# EAGLE design 2WLS-30W (EAGLE 7.4.0)

## Sheet 1 of 2
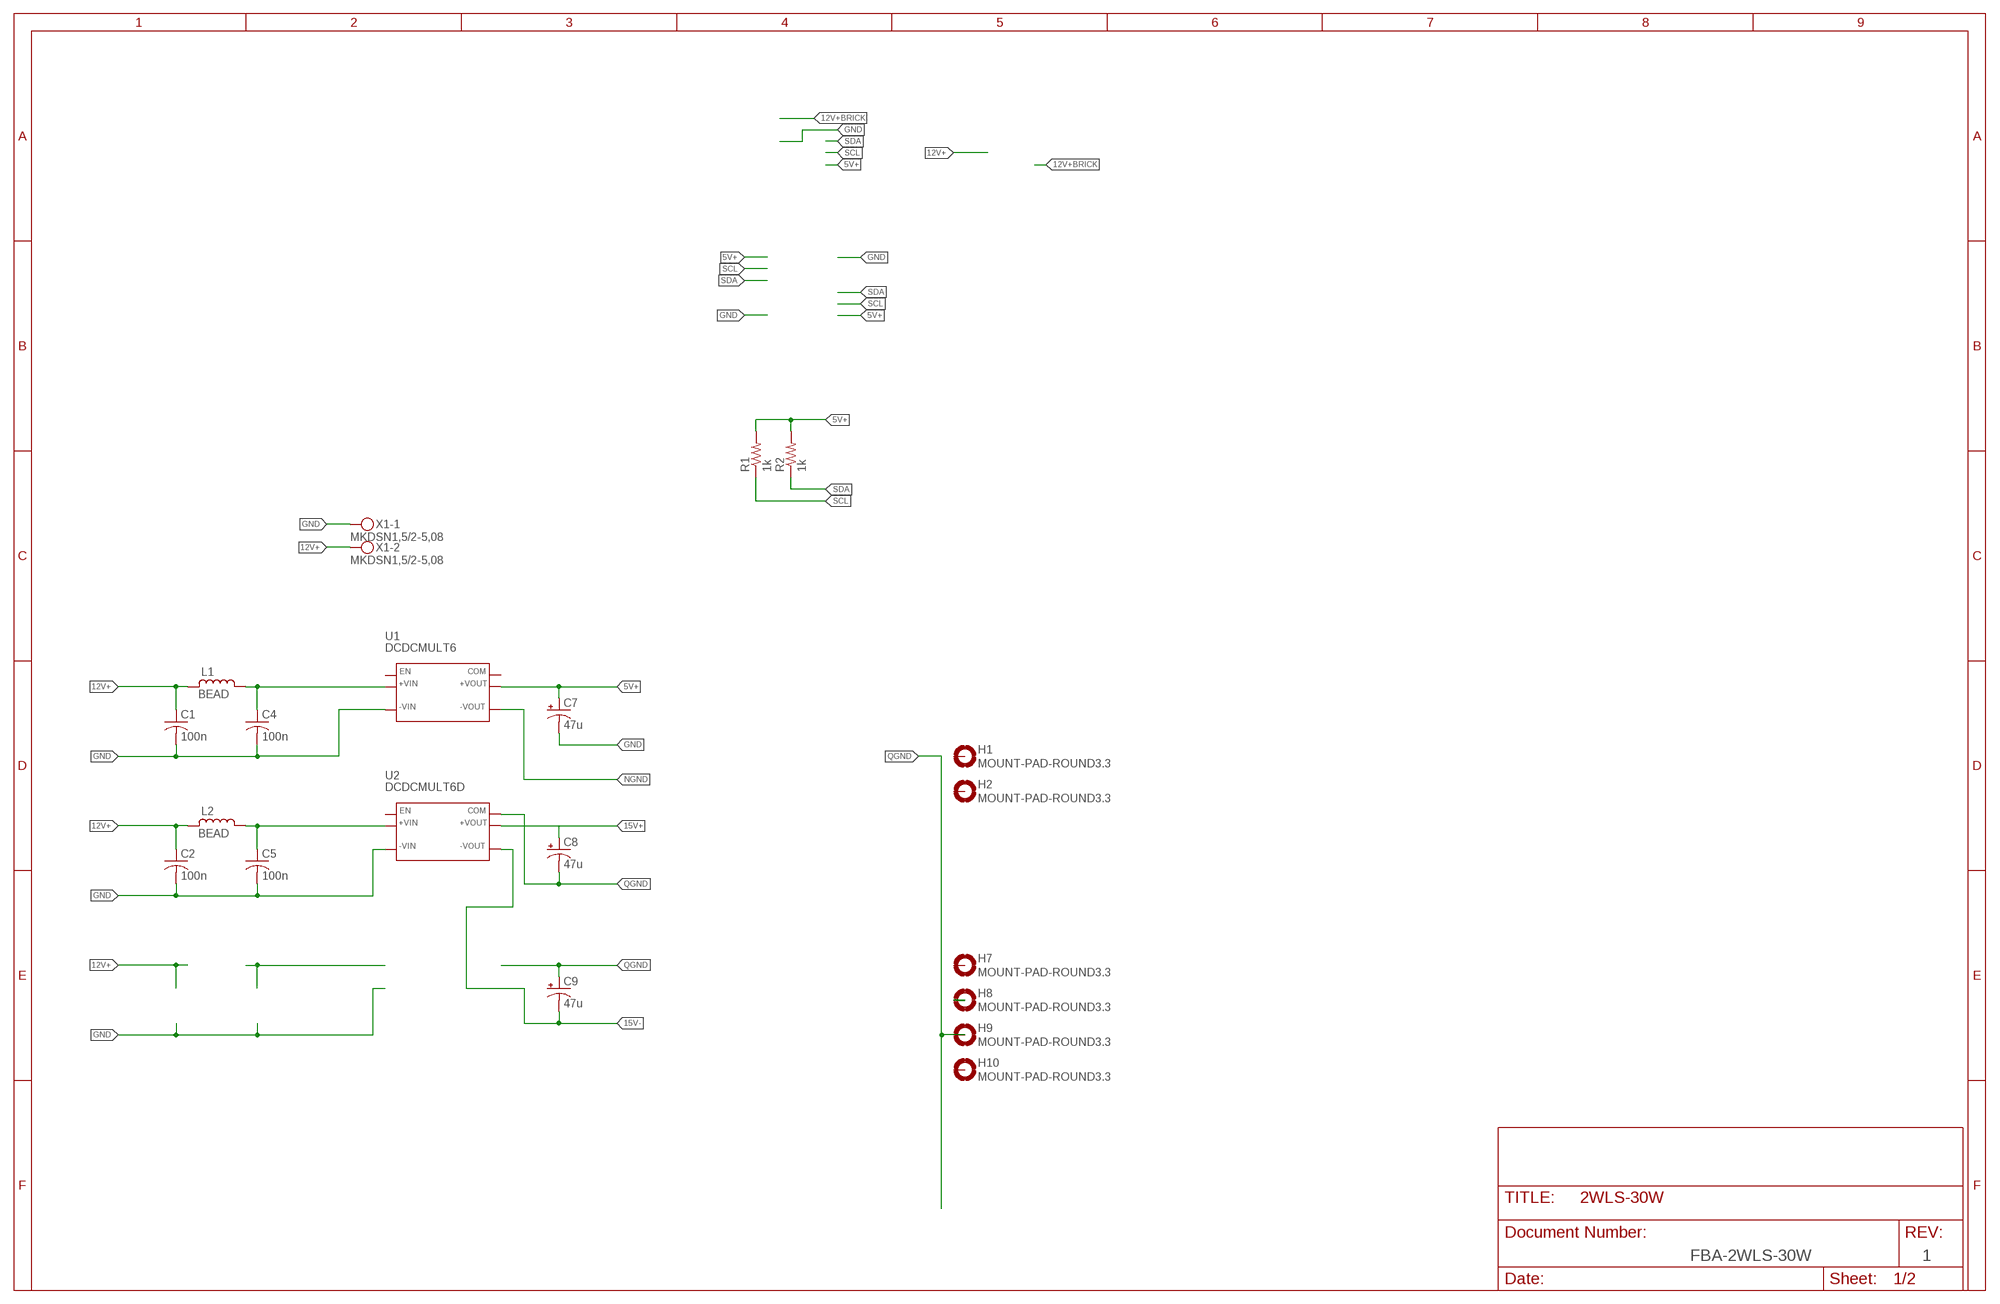
[diagram p0: schematic, sheet 1]

### Parts
C1  100n  C-US050-025X075  [C050-025X075]
C2  100n  C-US050-025X075  [C050-025X075]
C4  100n  C-US050-025X075  [C050-025X075]
C5  100n  C-US050-025X075  [C050-025X075]
C7  47u  CPOL-USE5-6  [E5-6]
C8  47u  CPOL-USE5-6  [E5-6]
C9  47u  CPOL-USE5-6  [E5-6]
H1  MOUNT-PAD-ROUND3.3  [3,3-PAD]
H2  MOUNT-PAD-ROUND3.3  [3,3-PAD]
H7  MOUNT-PAD-ROUND3.3  [3,3-PAD]
H8  MOUNT-PAD-ROUND3.3  [3,3-PAD]
H9  MOUNT-PAD-ROUND3.3  [3,3-PAD]
H10  MOUNT-PAD-ROUND3.3  [3,3-PAD]
L1  BEAD  L  [BEAD]
L2  BEAD  L  [BEAD]
R1  1k  R-US_0207/7  [0207/7]
R2  1k  R-US_0207/7  [0207/7]
U1  DCDCMULT6  [EC6CMULT]
U2  DCDCMULT6D  [EC6CMULTD]
X1  MKDSN1,5/2-5,08  [MKDSN1,5/2-5,08]

### Nets
5V+: C7.+ R1.2 R2.2 U1.VO1+(+VOUT) U1.VO+(+VOUT)
12V+: C1.1 C2.1 L1.1 L2.1 X1.2
15V+: C8.+ U2.VO1+(+VOUT) U2.VO+(+VOUT)
15V-: C9.- U2.VO1-(-VOUT) U2.VO-(-VOUT)
GND: C1.2 C2.2 C4.2 C5.2 C7.- U1.VIN1-(-VIN) U1.VIN-(-VIN) U2.VIN1-(-VIN) U2.VIN-(-VIN) X1.1
N$1: C5.1 L2.2 U2.VIN1+(+VIN) U2.VIN+(+VIN)
N$3: C4.1 L1.2 U1.VIN1+(+VIN) U1.VIN+(+VIN)
N$5: H8.B3,3(MOUNT)
NGND: U1.VO1-(-VOUT) U1.VO-(-VOUT)
QGND: C8.- C9.+ U2.COM U2.COM1(COM)
SCL: R1.1
SDA: R2.1
Unconnected: H1.B3,3(MOUNT) H2.B3,3(MOUNT) H7.B3,3(MOUNT) H9.B3,3(MOUNT) H10.B3,3(MOUNT) U1.ONOFF1(EN) U1.ONOFF(EN) U2.ONOFF1(EN) U2.ONOFF(EN)

### Notes on the sheet
- FBA-2WLS-30W | 1

## Sheet 2 of 2
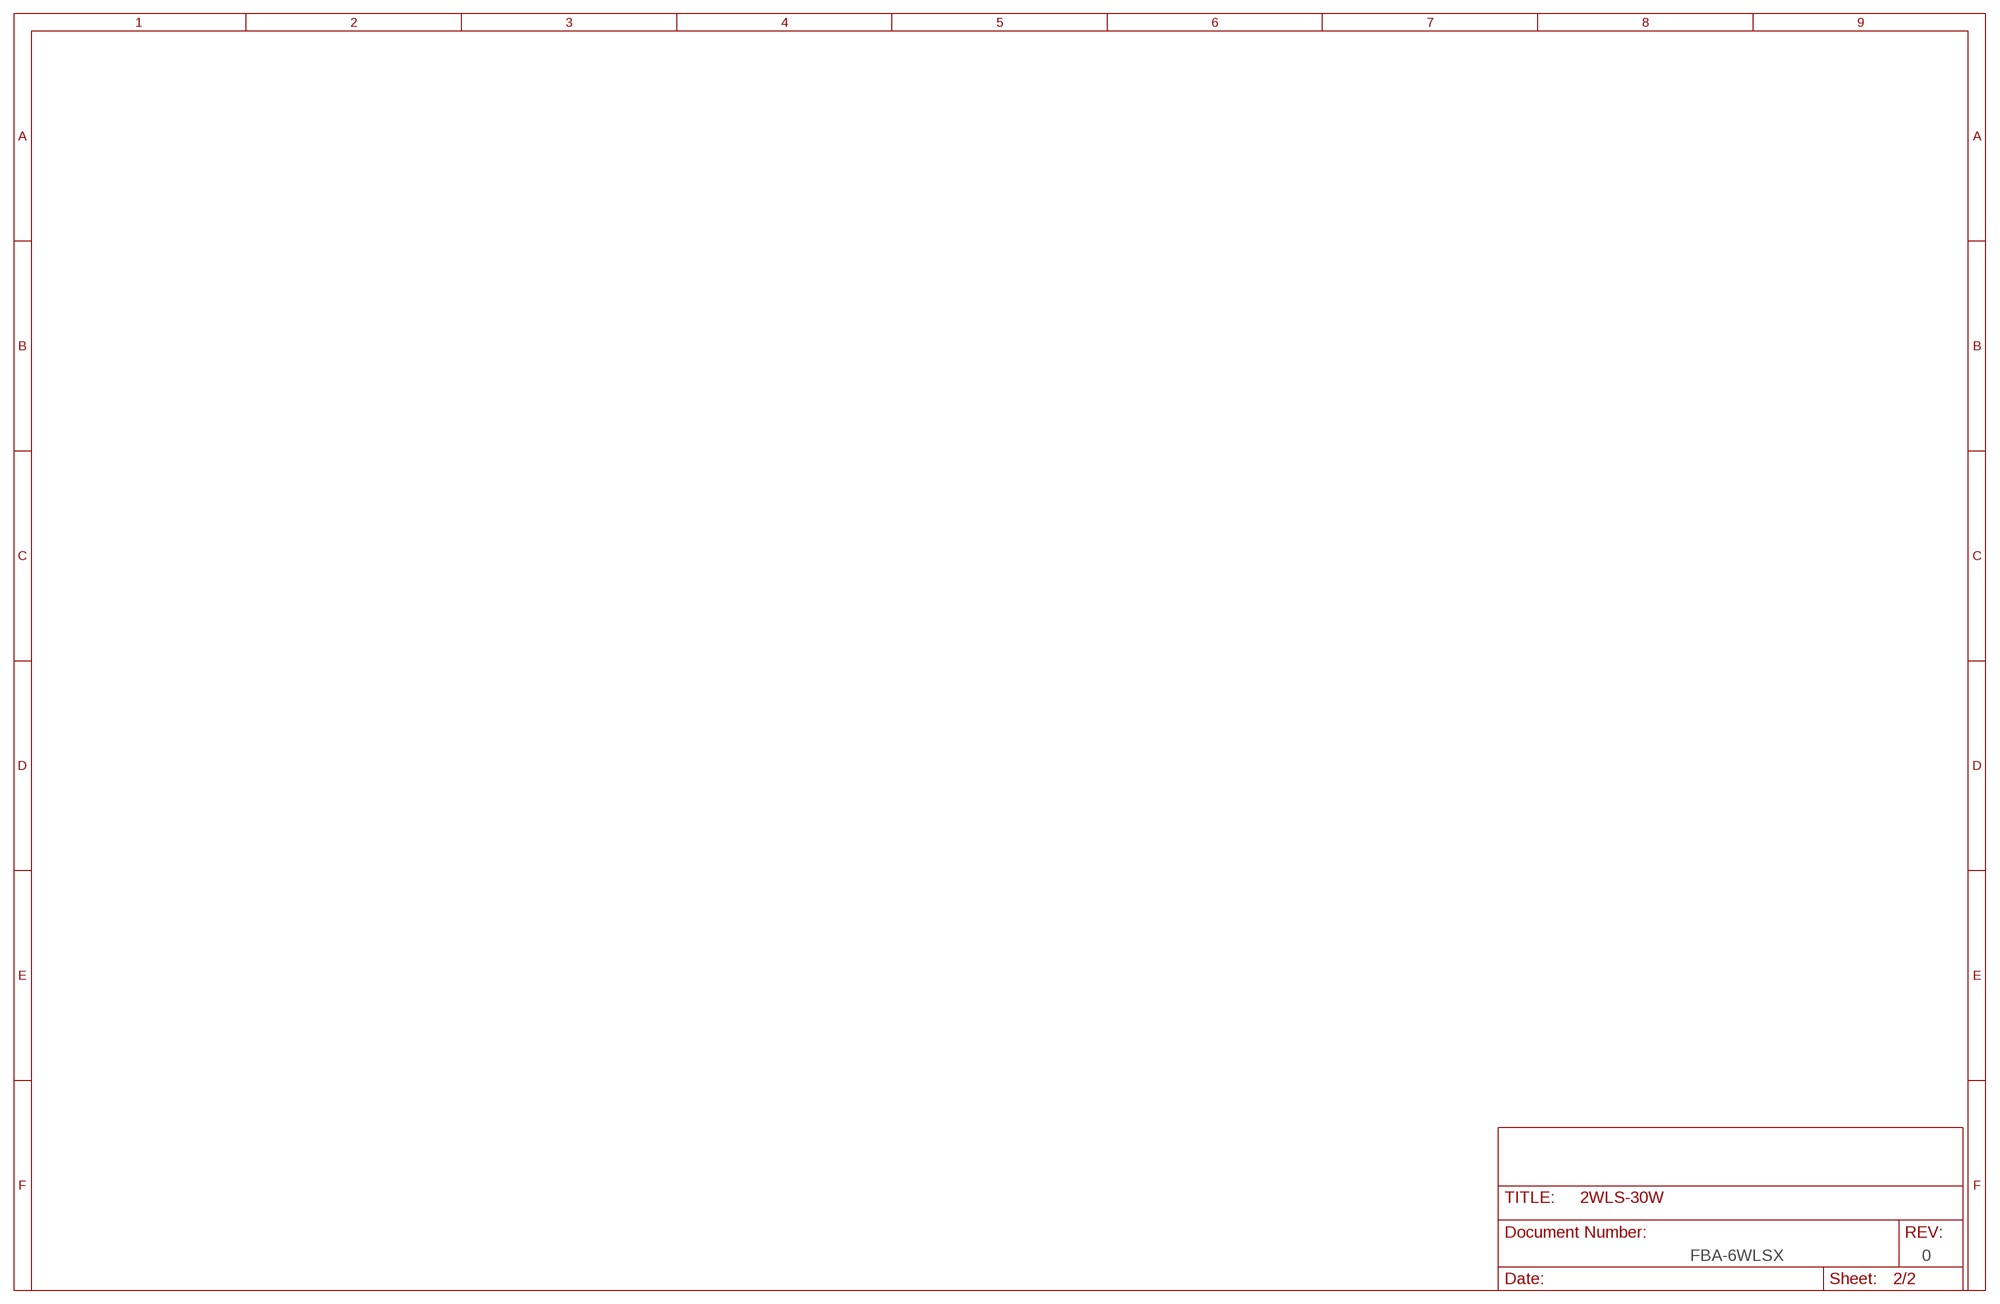
[diagram p1: schematic, sheet 2]

### Notes on the sheet
- FBA-6WLSX | 0

## Power pins joined to a net without a drawn wire
COM: U1.TRIM1(COM) U1.TRIM(COM)

## Library data of the parts
C1 C2 C4 C5 = resistor:C-US: CAPACITOR, American symbol
C7-C9 = resistor:CPOL-US: POLARIZED CAPACITOR, American symbol
H1 H2 H7-H10 = holes:MOUNT-PAD-ROUND: MOUNTING PAD, round
L1 L2 = studio_h:L: Inductor; MF: LAIRD; MPN: 28L0138-80R-10; Z_DIGIKEY: 240-2513-2-ND; Z_SMT: N
R1 R2 = resistor:R-US_: RESISTOR, American symbol
U1 U2 = studio_h:DCDC: DCDC Converter
X1 = con-phoenix-508:MKDSN1,5/2-5,08: MKDSN 1,5/ 2-5,08 Printklemme Nennstrom: 13,5 A Nennspannung: 250 V Rastermaß: 5,08 mm Polzahl: 2 Anschlussart: Schraubanschluss Montage: Löten Anschlussrichtung Leiter/Platine: 0 ° Artikelnummer: 1729128 Source: http://eshop.phoenixcontact.com .. 1729128.pdf

## Net classes
0 Signal: width 0.254 mm, clearance 0.205 mm
1 Power: width 0.508 mm, clearance 0.205 mm to class 0, clearance 0.205 mm
2 GND: width 0.889 mm

## Board
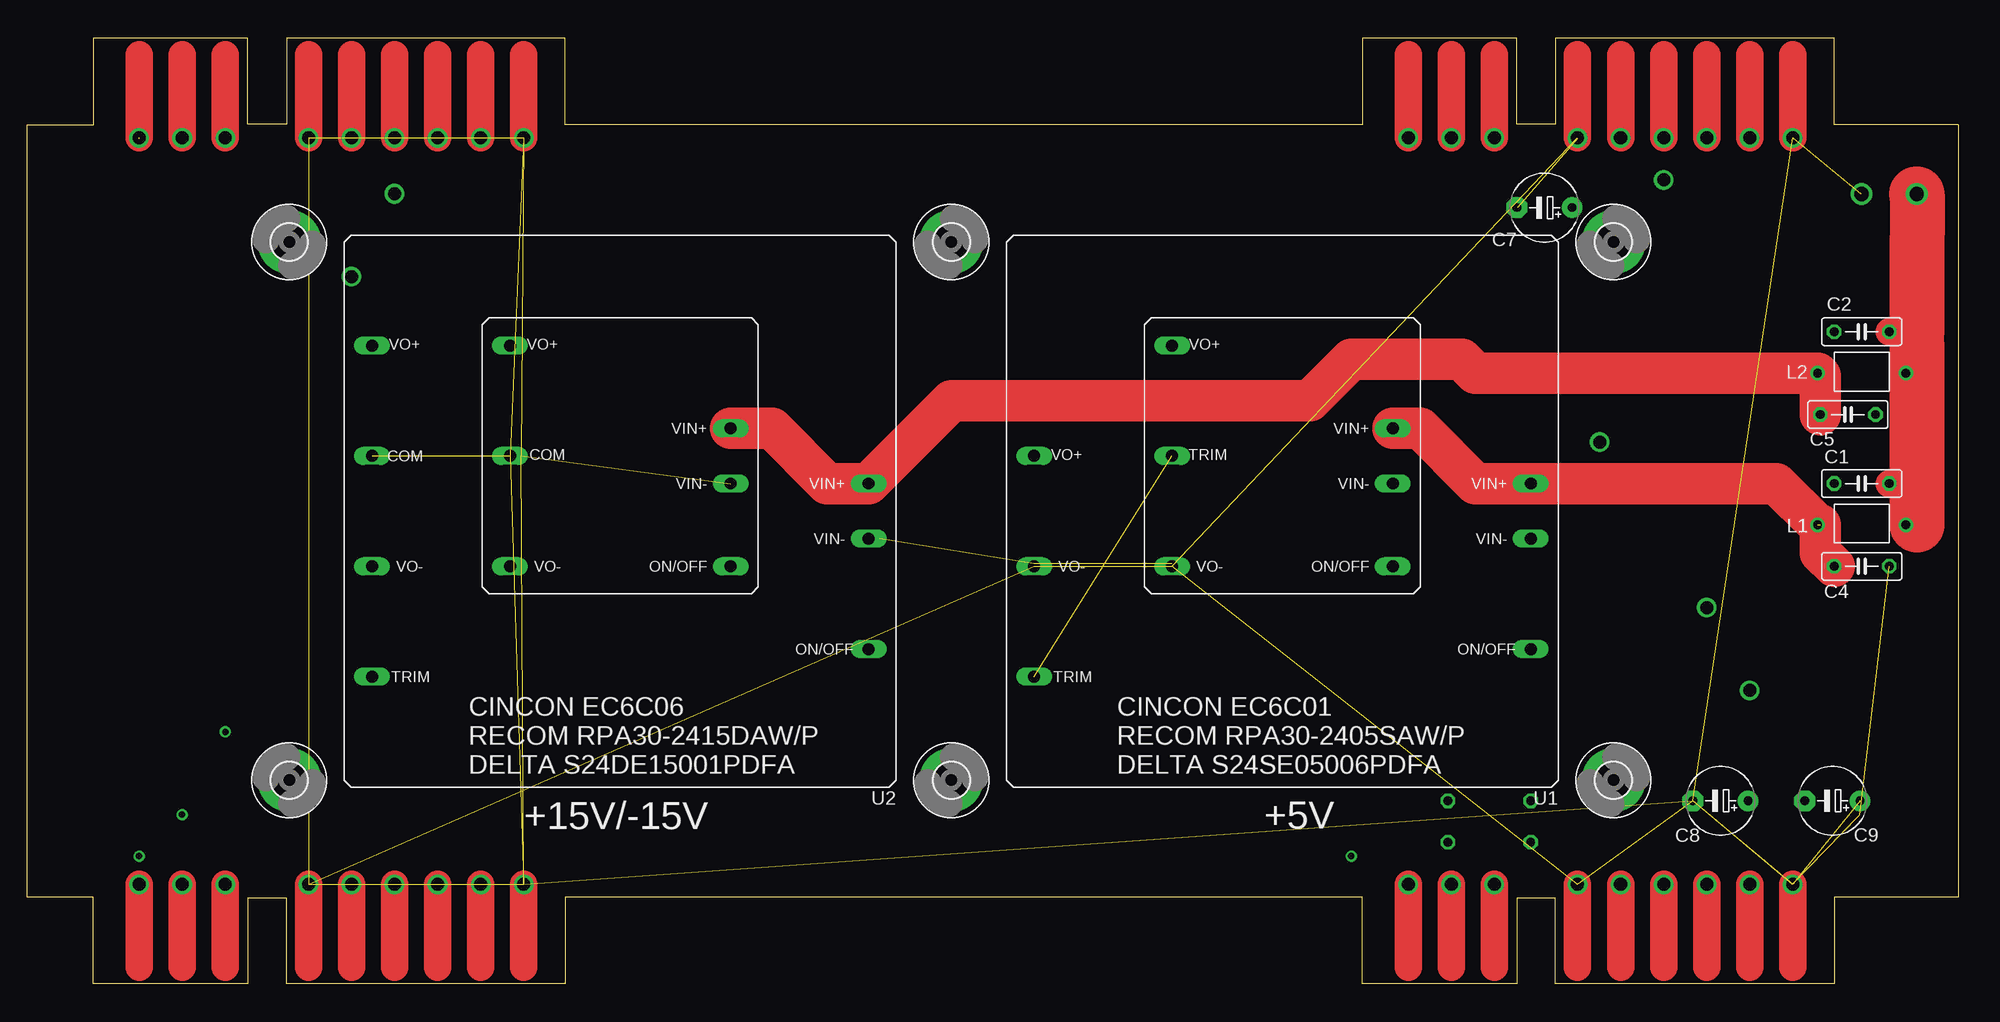
[diagram p2: board, top side]
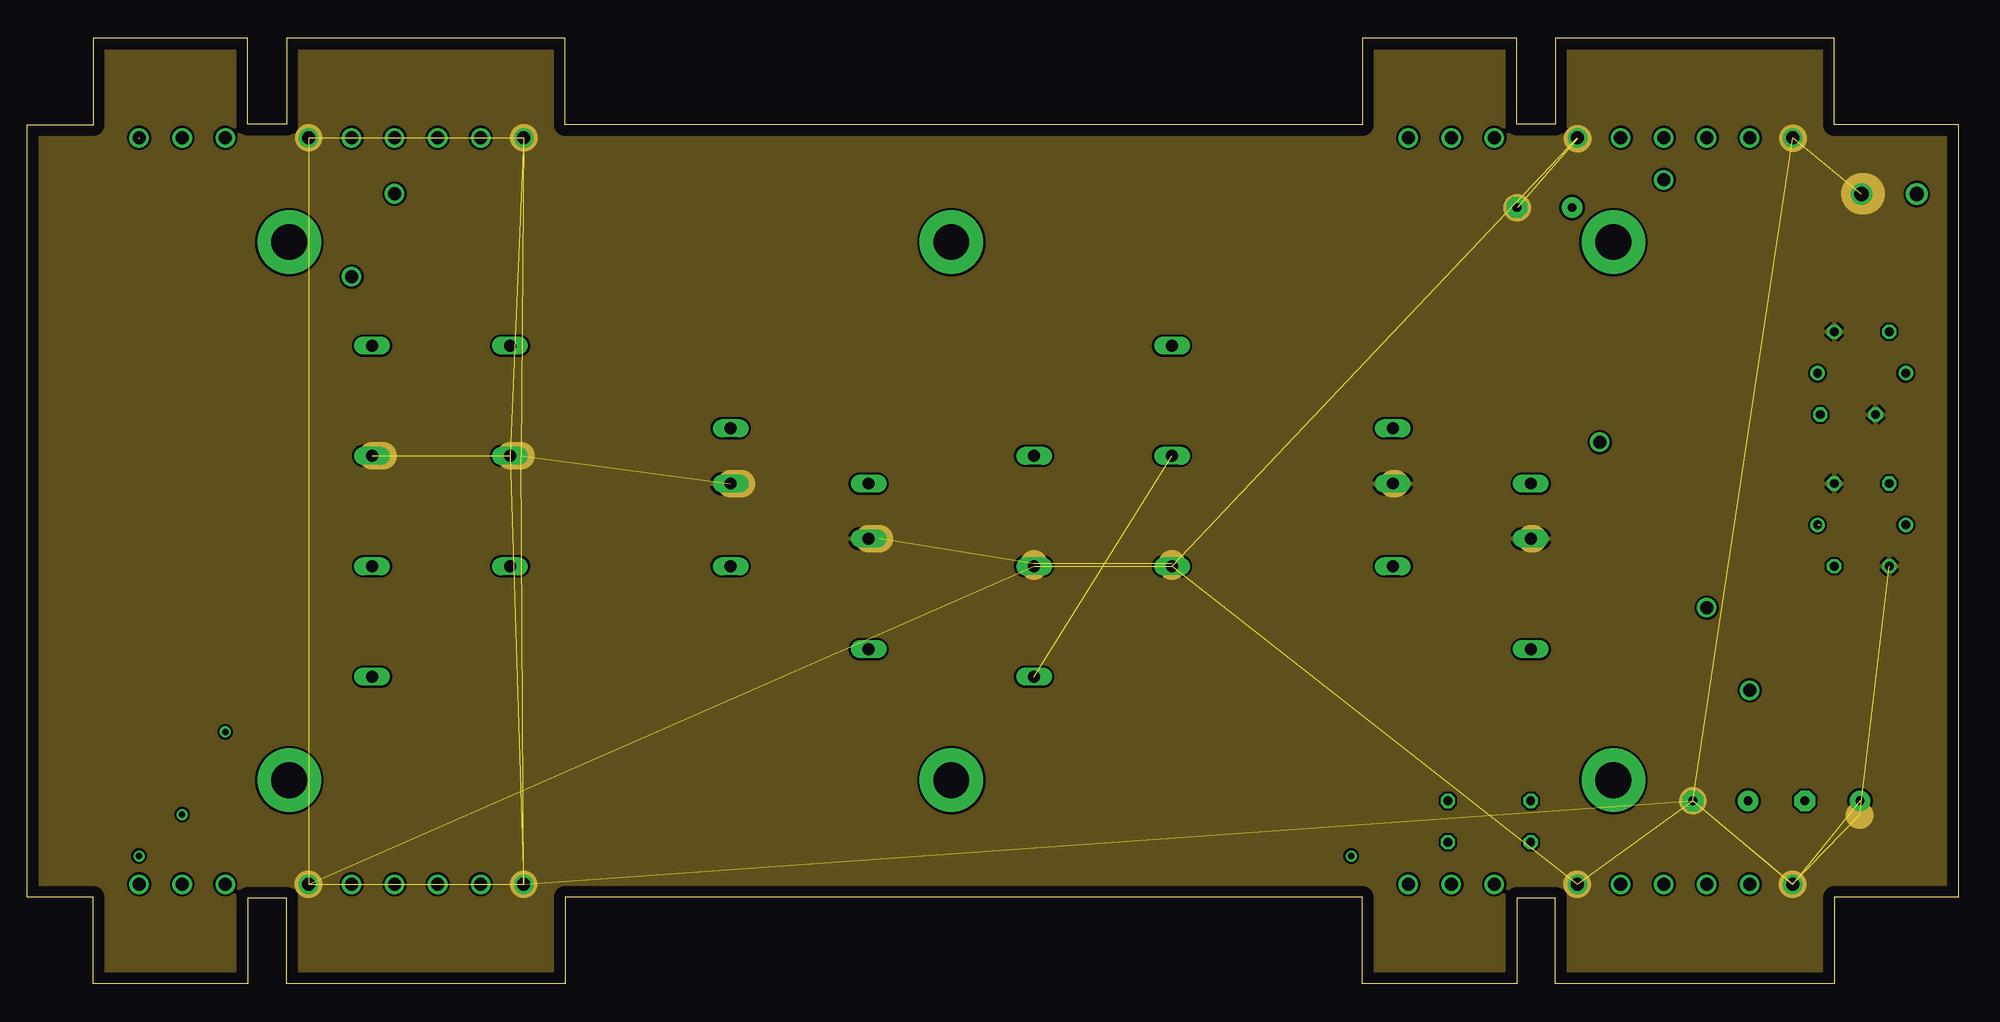
[diagram p3: board, inner layer Route2]
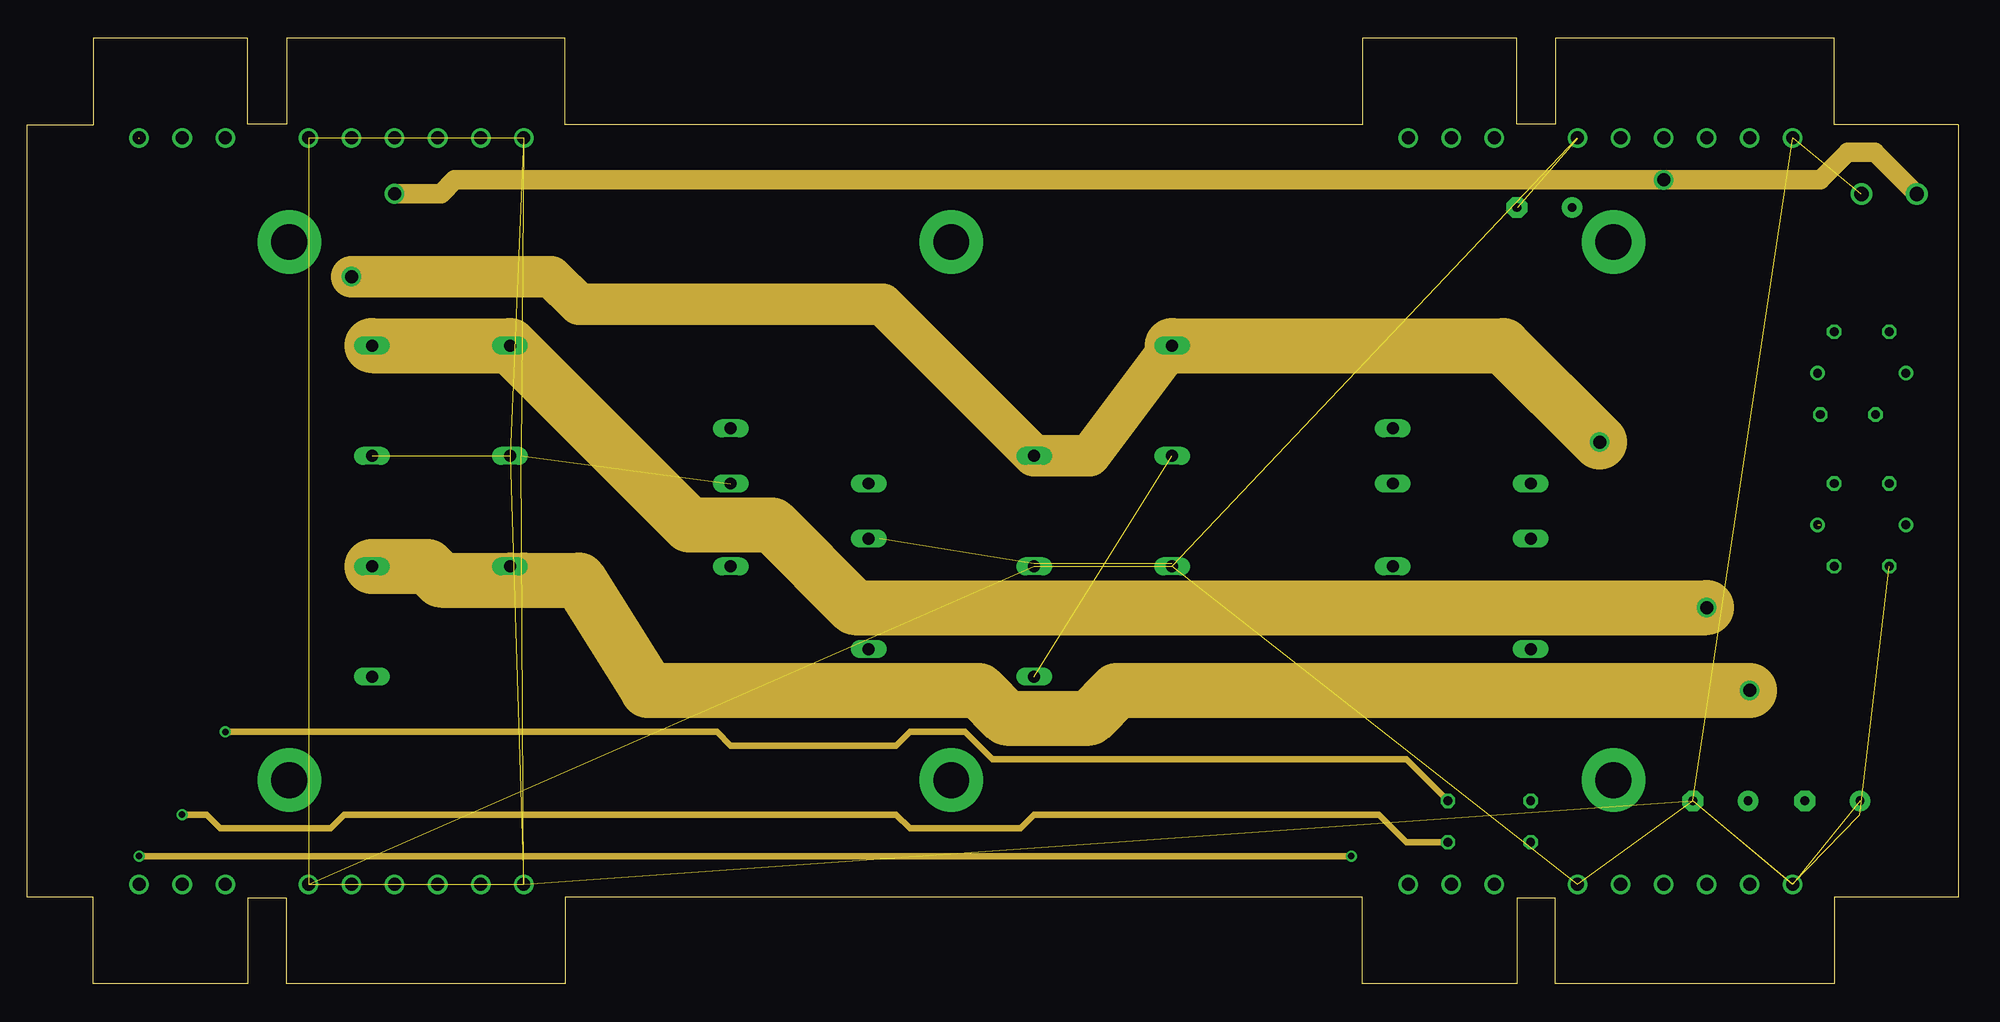
[diagram p4: board, inner layer Route15]
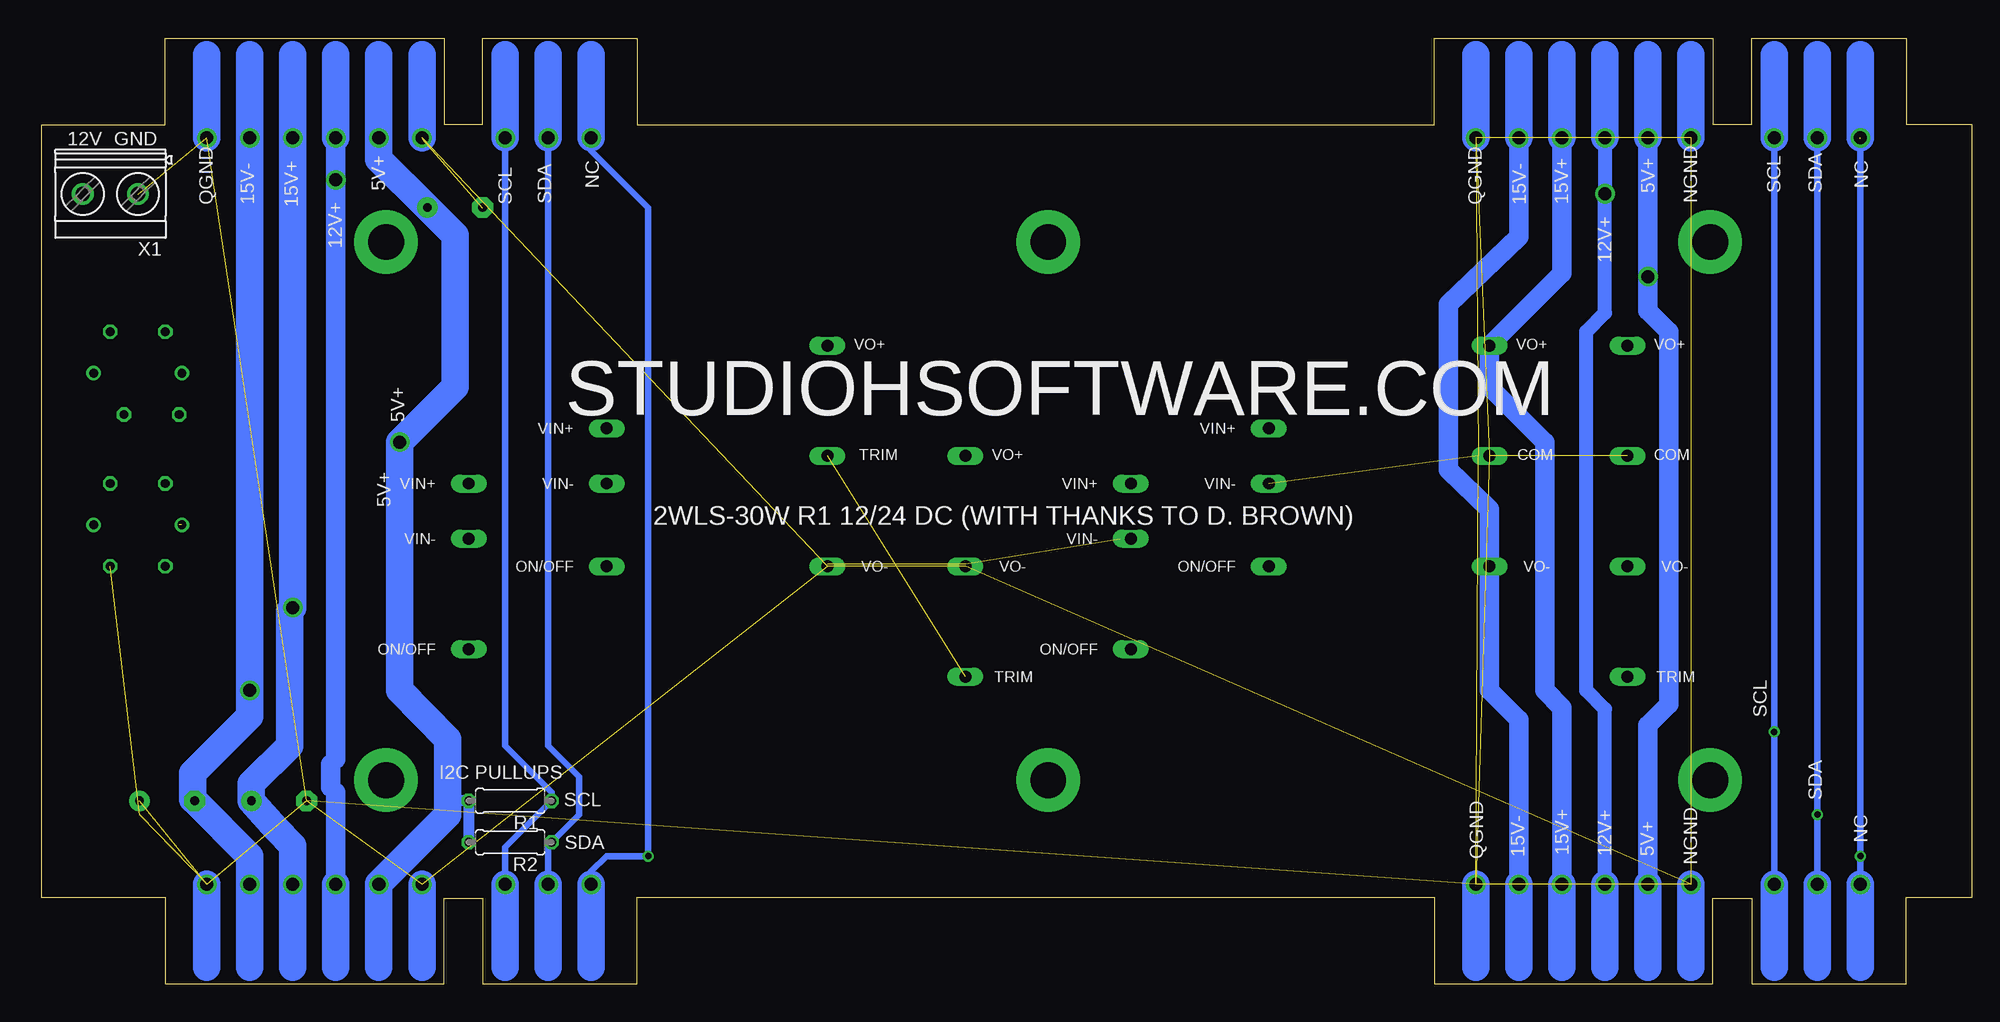
[diagram p5: board, bottom side, seen from below]

Size 177.8 x 87 mm. Coordinates in mm from the lower left corner, seen from the top.
Outline: 49.53,7.94 49.53,0 23.88,0 23.88,7.87 20.32,7.87 20.32,0 6.1,0 6.1,7.94 0,7.94 0,79.06 6.1,79.06 6.1,87 20.32,87 20.32,79.12 23.88,79.12 23.88,87 49.53,87 49.53,79.06 122.94,79.06 122.94,87 137.16,87 137.16,79.12 140.72,79.12 140.72,87 166.37,87 166.37,79.06 177.8,79.06 177.8,7.94 166.37,7.94 166.37,0 140.72,0 140.72,7.87 137.16,7.87 137.16,0 122.94,0 122.94,7.94 49.53,7.94
Copper layers (1*2*15*16): Top 0.035mm / dielectric 0.2mm / Route2 0.035mm / dielectric 1mm / Route15 0.035mm / dielectric 0.2mm / Bottom 0.035mm
Design rules "default *": minimum track width 10mil, minimum drill 20mil, track to track 8mil, track to pad 8mil, pad to pad 8mil, via to via 8mil, smd to smd 8mil, copper to edge 40mil, drill to drill 8mil, minimum pad ring 10mil, minimum via ring 8mil, stop-mask expansion 4mil, vias tented up to drill 0mil, thermal gap 10mil

### Footprints (pad centres in the part's own frame; a part is rotated, then mirrored left to right if it is on the bottom)
C050-025X075 = drill 0.813 octagon: 1 -2.54,0; 2 2.54,0
E5-6 = drill 0.813 pad 1.905: + -2.54,0 | drill 0.813 pad 1.905 octagon: - 2.54,0
3,3-PAD = drill 3.3 pad 5.842: B3,3 0,0
BEAD = drill 0.813: 1 -4.064,0; 2 4.064,0
0207/7 = drill 0.813 octagon: 1 -3.81,0; 2 3.81,0
EC6CMULT = drill 1.1 long: ONOFF -22.86,12.7; ONOFF1 -10.16,5.08; TRIM 22.86,15.24; TRIM1 10.16,-5.08; VIN1+ -10.16,-7.62; VIN1- -10.16,-2.54; VIN+ -22.86,-2.54; VIN- -22.86,2.54; VO1+ 10.16,-15.24; VO1- 10.16,5.08; VO+ 22.86,-5.08; VO- 22.86,5.08
EC6CMULTD = drill 1.1 long: COM 22.86,-6.35; COM1 10.16,-6.35; ONOFF -22.86,11.43; ONOFF1 -10.16,3.81; TRIM 22.86,13.97; VIN1+ -10.16,-8.89; VIN1- -10.16,-3.81; VIN+ -22.86,-3.81; VIN- -22.86,1.27; VO1+ 10.16,-16.51; VO1- 10.16,3.81; VO+ 22.86,-16.51; VO- 22.86,3.81
MKDSN1,5/2-5,08 = drill 1.3 pad 2: 1 -2.561,0.025; 2 2.519,0.025

### Placement (x,y rotation side)
C1  168.91,46.04 180 top
C2  168.91,60.01 180 top
C4  168.91,38.42 0 top
C5  167.64,52.39 0 top
C7  139.7,71.44 180 top
C8  155.91,16.83 180 top
C9  166.22,16.83 180 top
H1  24.13,68.26 270 top
H2  24.13,18.73 270 top
H7  85.09,68.26 0 top
H8  85.09,18.73 0 top
H9  146.05,68.26 0 top
H10  146.05,18.73 0 top
L1  168.91,42.23 180 top
L2  168.91,56.2 180 top
R1  134.62,16.83 180 bottom
R2  134.62,13.02 180 bottom
U1  115.57,43.5 180 top
U2  54.61,42.23 180 top
X1  171.45,72.71 180 bottom

### Tracks (layer width: path | path; a pad name or v marks a point on that pad's centre or on a via)
5V+  (via drill 1.2)
  Top 2.54: v29.87,9.14 29.87,1.52 | v29.87,77.85 29.87,85.5 | v146.71,9.14 146.71,1.52 | v146.71,77.85 146.71,85.5
  Route15 3.81: v29.87,65.09 48.26,65.09 50.8,62.55 78.74,62.55 U1.VO+ 97.79,48.58 U1.VO1+
  Route15 5.08: U1.VO1+ 135.89,58.74 v144.78,49.85
  Bottom 1.016: R2.2 R1.2 140.36,16.83
  Bottom 1.778: v29.87,77.85 v29.87,65.09 29.87,61.94 27.94,60.01 27.94,25.72 29.87,23.79 v29.87,9.14
  Bottom 2.54: v29.87,9.14 29.87,1.52 | v29.87,77.85 29.87,85.5 | 146.71,1.52 v146.71,9.14 146.71,9.21 140.36,15.56 140.36,16.83 140.36,22.52 144.78,26.99 v144.78,49.85 139.7,54.93 139.7,68.9 C7.+ 146.71,75.91 v146.71,77.85 146.71,85.5
12V+  (via drill 1.2)
  Top 2.54: v33.83,9.14 33.83,1.52 | v33.83,77.85 33.83,85.5 | v150.67,9.14 150.67,1.52 | v150.67,77.85 150.67,85.5 | 173.35,58.1 173.99,58.74 | C2.1 172.44,60.01 172.39,60.06 173.94,60.06 173.99,60.01 | 172.72,56.2 L2.1 173.99,56.2 | C1.1 172.59,46.04 172.52,46.11 172.64,46.11 C1.1 | C1.1 173.99,46.04 | 172.72,42.23 L1.1 173.99,42.23
  Top 5.08: 173.99,42.23 173.99,46.04 173.99,56.2 173.99,58.74 173.99,60.01 173.99,65.09 174.02,72.68 X1.2
  Route15 1.778: v33.83,72.71 38.1,72.71 39.37,73.98 v150.67,73.98 165.1,73.98 167.64,76.52 170.13,76.52 X1.2
  Bottom 1.27: v33.83,9.14 33.83,25.26 35.56,26.99 35.56,60.01 33.83,61.73 v33.83,72.71 v33.83,77.85
  Bottom 1.778: v150.67,9.14 150.67,17.64 151.13,18.1 151.13,20.18 150.67,20.64 v150.67,73.98 v150.67,77.85
  Bottom 2.54: v33.83,9.14 33.83,1.52 | v33.83,77.85 33.83,85.5 | v150.67,9.14 150.67,1.52 | v150.67,77.85 150.67,85.5
15V+  (via drill 1.2)
  Top 2.54: v37.79,9.14 37.79,1.52 | v37.79,77.85 37.79,85.5 | v154.64,9.14 154.64,1.52 | v154.64,77.85 154.64,85.5
  Route15 5.08: v154.64,34.61 76.2,34.61 68.58,42.23 60.96,42.23 U2.VO1+ U2.VO+
  Bottom 1.778: v37.79,9.14 37.79,25.41 39.37,26.99 39.37,49.85 44.45,54.93 U2.VO1+ 37.79,65.39 v37.79,77.85
  Bottom 2.54: v37.79,9.14 37.79,1.52 | v37.79,77.85 37.79,85.5 | 154.64,1.52 v154.64,9.14 154.64,12.71 156.21,14.29 C8.+ 158.45,18.4 154.94,21.91 154.94,34.3 v154.64,34.61 v154.64,77.85 154.64,85.5
15V-  (via drill 1.2)
  Top 2.54: v41.76,9.14 41.76,1.52 | v41.76,77.85 41.76,85.5 | v158.6,9.14 158.6,1.52 | v158.6,77.85 158.6,85.5
  Route15 2.54: U2.VO1- 45.72,37.15
  Route15 5.08: v158.6,26.99 100.33,26.99 97.79,24.45 90.17,24.45 87.63,26.99 57.15,26.99 50.8,37.15 45.72,37.15 38.1,37.15 36.83,38.42 U2.VO-
  Bottom 1.778: v41.76,9.14 41.76,24.3 44.45,26.99 U2.VO1- 44.45,43.65 48.26,47.31 48.26,62.55 41.76,68.75 v41.76,77.85
  Bottom 2.54: v41.76,9.14 41.76,1.52 | v41.76,77.85 41.76,85.5 | 158.6,1.52 v158.6,9.14 158.6,11.75 C9.- 163.83,16.98 163.83,19.37 158.6,24.6 v158.6,26.99 v158.6,77.85 158.6,85.5
COM  (1 unrouted)
GND  (14 unrouted)
  Route2 2.54: 125.98,46.04 U1.VIN1- | 105.41,38.67 105.41,38.42 | 92.71,38.67 92.71,38.42 | U2.VIN- 78.49,40.96 | 25.91,77.86 25.93,77.86 | 45.72,77.86 45.74,77.86 | 25.88,9.13 25.91,9.13 | 45.7,9.13 45.72,9.13 | 142.7,9.16 142.72,9.16 | 162.53,9.13 162.56,9.13 | 142.75,77.79 142.77,77.79 | 162.59,77.81 162.61,77.81 | 168.73,15.48 168.71,15.48 | 153.34,16.85 153.36,16.85 | 137.16,71.41 137.18,71.41 | 138.68,40.96 U1.VIN- | U2.VIN1- 65.79,46.04 | 44.45,48.58 45.47,48.58 | 31.75,48.58 32.77,48.58
  Route2 3.81: 169.16,72.71 168.91,72.71
  pour Route2: 0,79.06 0,7.94 6.35,7.94 6.35,0.32 49.53,0.32 49.53,7.94 123.19,7.94 123.19,0.32 166.37,0.32 166.37,7.94 177.8,7.94 177.8,79.06 166.37,79.06 166.37,86.68 123.19,86.68 123.19,79.06 49.53,79.06 49.53,86.68 6.35,86.68 6.35,79.06
N$1
  Top 3.81: U2.VIN1+ 68.58,51.12 73.66,46.04 U2.VIN+ 85.09,53.66 118.11,53.66 121.92,57.47 132.08,57.47 133.35,56.2 L2.2 165.1,55.94 C5.1
N$3  (1 unrouted)
  Top 3.81: U1.VIN1+ 128.27,51.12 133.35,46.04 U1.VIN+ 161.04,46.04 L1.2 | 165.1,42.23 165.1,39.69 C4.1
NC  (via drill 0.6, 1.2)  (1 unrouted)
  Top 2.54: v10.31,9.14 10.31,1.52 | v10.31,77.85 10.31,85.5 | v127.15,9.14 127.15,1.52 | v127.15,77.85 127.15,85.5
  Route15 0.61: v10.31,11.75 v121.92,11.75
  Bottom 0.61: v10.31,9.14 v10.31,11.75 10.31,77.79 | v127.15,9.14 127.15,10.33 125.73,11.75 v121.92,11.75 121.92,71.44 127.15,76.67 v127.15,77.85
  Bottom 2.54: v10.31,9.14 10.31,1.52 | v10.31,77.85 10.31,85.5 | v127.15,9.14 127.15,1.52 | v127.15,77.85 127.15,85.5
NGND  (via drill 1.2)  (5 unrouted)
  Top 2.54: v142.75,9.14 142.75,1.52 | v142.75,77.85 142.75,85.5 | v25.91,9.14 25.91,1.52 | v25.91,77.85 25.91,85.5
  Bottom 2.54: v142.75,9.14 142.75,1.52 | v142.75,77.85 142.75,85.5 | v25.91,9.14 25.91,1.52 | v25.91,77.85 25.91,85.5
QGND  (via drill 1.2)  (7 unrouted)
  Top 2.54: v45.72,9.14 45.72,1.52 | 45.72,85.5 v45.72,77.85 | v162.56,9.14 162.56,1.52 | 162.56,85.5 v162.56,77.85
  Bottom 2.54: 45.72,1.52 v45.72,9.14 | v45.72,77.85 45.72,85.5 | 162.56,1.52 v162.56,9.14 | v162.56,77.85 162.56,85.5
SCL  (via drill 0.6, 1.2)
  Top 2.54: v18.24,9.14 18.24,1.52 | v18.24,77.85 18.24,85.5 | v135.08,9.14 135.08,1.52 | v135.08,77.85 135.08,85.5
  Route15 0.61: v18.24,23.18 63.5,23.18 64.77,21.91 80.01,21.91 81.28,23.18 86.36,23.18 88.9,20.64 127,20.64 R1.1
  Bottom 0.61: v135.08,9.14 135.08,12.56 R1.1 130.81,17.64 135.08,21.91 v135.08,77.85 | v18.24,9.14 v18.24,23.18 v18.24,77.85
  Bottom 2.54: v18.24,9.14 18.24,1.52 | v18.24,77.85 18.24,85.5 | v135.08,9.14 135.08,1.52 | v135.08,77.85 135.08,85.5
SDA  (via drill 0.6, 1.2)
  Top 2.54: v14.28,9.14 14.28,1.52 | v14.28,77.85 14.28,85.5 | v131.11,9.14 131.11,1.52 | v131.11,77.85 131.11,85.5
  Route15 0.61: R2.1 127,13.02 124.46,15.56 92.71,15.56 91.44,14.29 81.28,14.29 80.01,15.56 29.21,15.56 27.94,14.29 17.78,14.29 16.51,15.56 v14.28,15.56
  Bottom 0.61: v131.11,9.14 131.11,12.71 R2.1 128.27,15.56 128.27,19.06 131.11,21.91 v131.11,77.85 | v14.28,77.85 v14.28,15.56 v14.28,9.14
  Bottom 2.54: v14.28,9.14 14.28,1.52 | v14.28,77.85 14.28,85.5 | v131.11,9.14 131.11,1.52 | v131.11,77.85 131.11,85.5

### Text on the board
tNames: CINCON EC6C06 / RECOM RPA30-2415DAW/P / DELTA S24DE15001PDFA | CINCON EC6C01 / RECOM RPA30-2405SAW/P / DELTA S24SE05006PDFA | +15V/-15V | +5V
bNames: GND | 12V | NC | SDA | SCL | 5V+ | NC | 5V+ | NGND | 15V+ | 15V- | QGND | SDA | SCL | 15V+ | 15V- | QGND | 12V+ | 12V+ | STUDIOHSOFTWARE.COM | 5V+ | 5V+ | 2WLS-30W R1 12/24 DC (WITH THANKS TO D. BROWN) | SCL | I2C PULLUPS | SDA | SCL | NC | 5V+ | 12V+ | 15V+ | 15V- | QGND | SDA | NGND